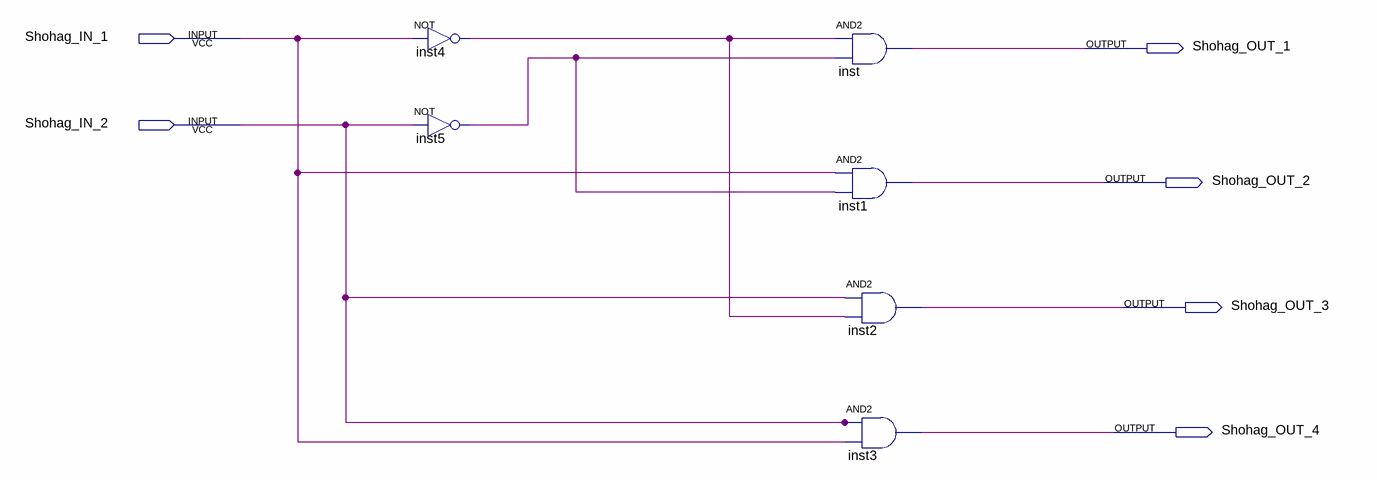
[diagram p0: schematic sheet]
// Quartus schematic Shohag_2to4_Decoder_blockDiagram.bdf as structural Verilog: 6 symbols, 6 pins
module Shohag_2to4_Decoder_blockDiagram (
  input  Shohag_IN_1,
  input  Shohag_IN_2,
  output Shohag_OUT_1,
  output Shohag_OUT_2,
  output Shohag_OUT_3,
  output Shohag_OUT_4
);

  wire inst4_out, inst5_out;

  not inst4 (inst4_out, Shohag_IN_1);
  not inst5 (inst5_out, Shohag_IN_2);
  and inst (Shohag_OUT_1, inst4_out, inst5_out);
  and inst1 (Shohag_OUT_2, Shohag_IN_1, inst5_out);
  and inst2 (Shohag_OUT_3, Shohag_IN_2, inst4_out);
  and inst3 (Shohag_OUT_4, Shohag_IN_2, Shohag_IN_1);
endmodule
